# EasyEDA Pro project 四路舵机降压板.epro, board PCB1
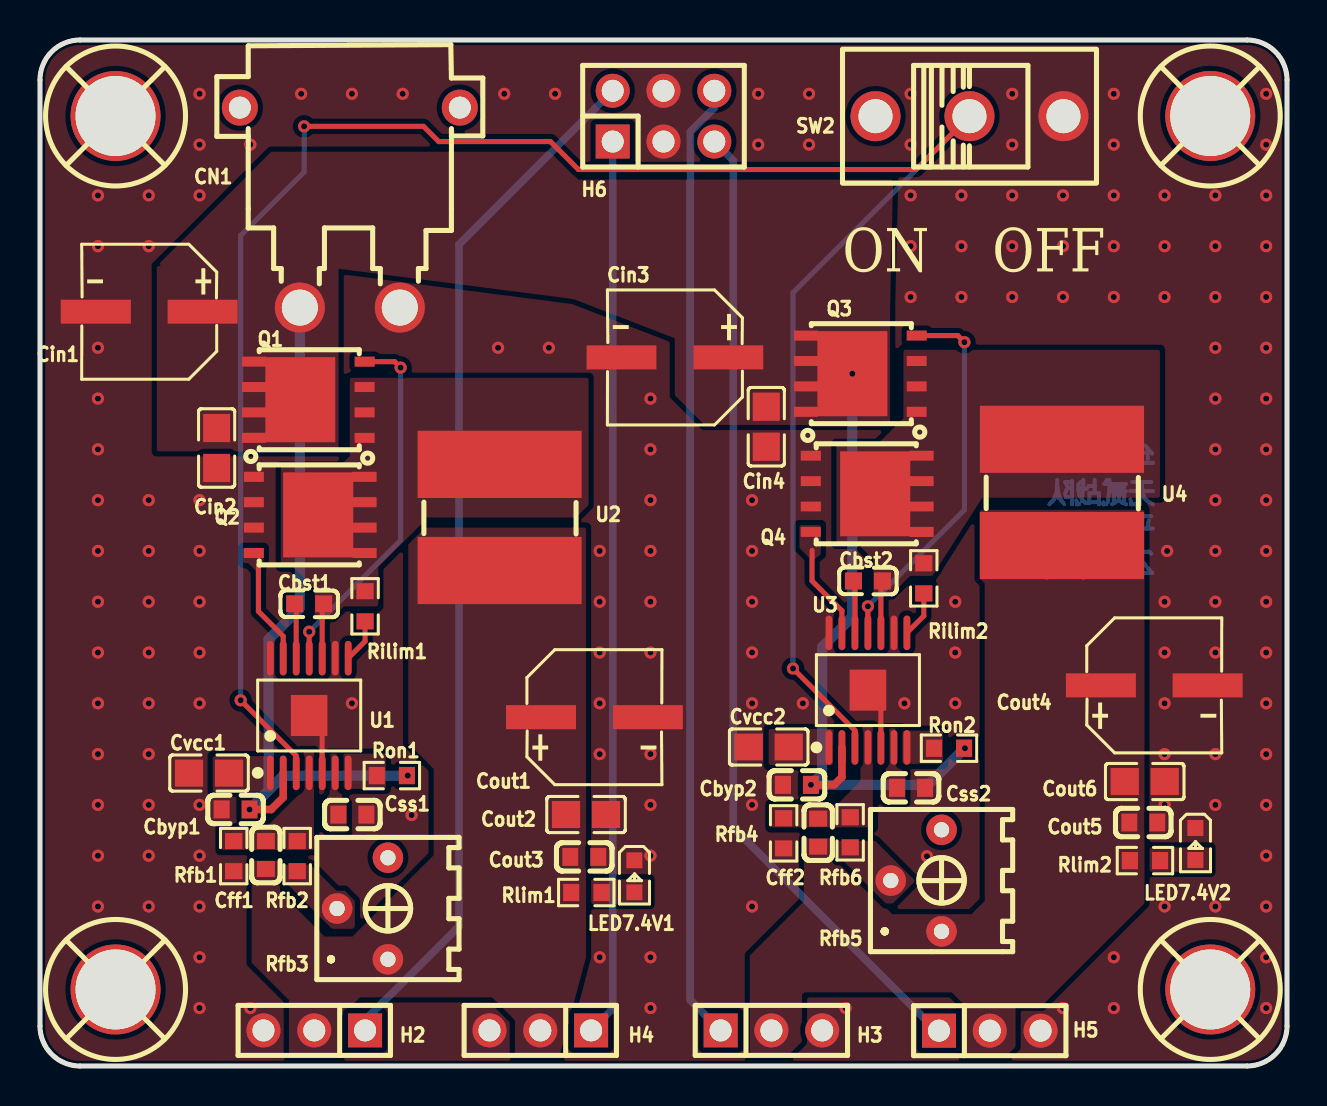
[diagram p3: board, top side]
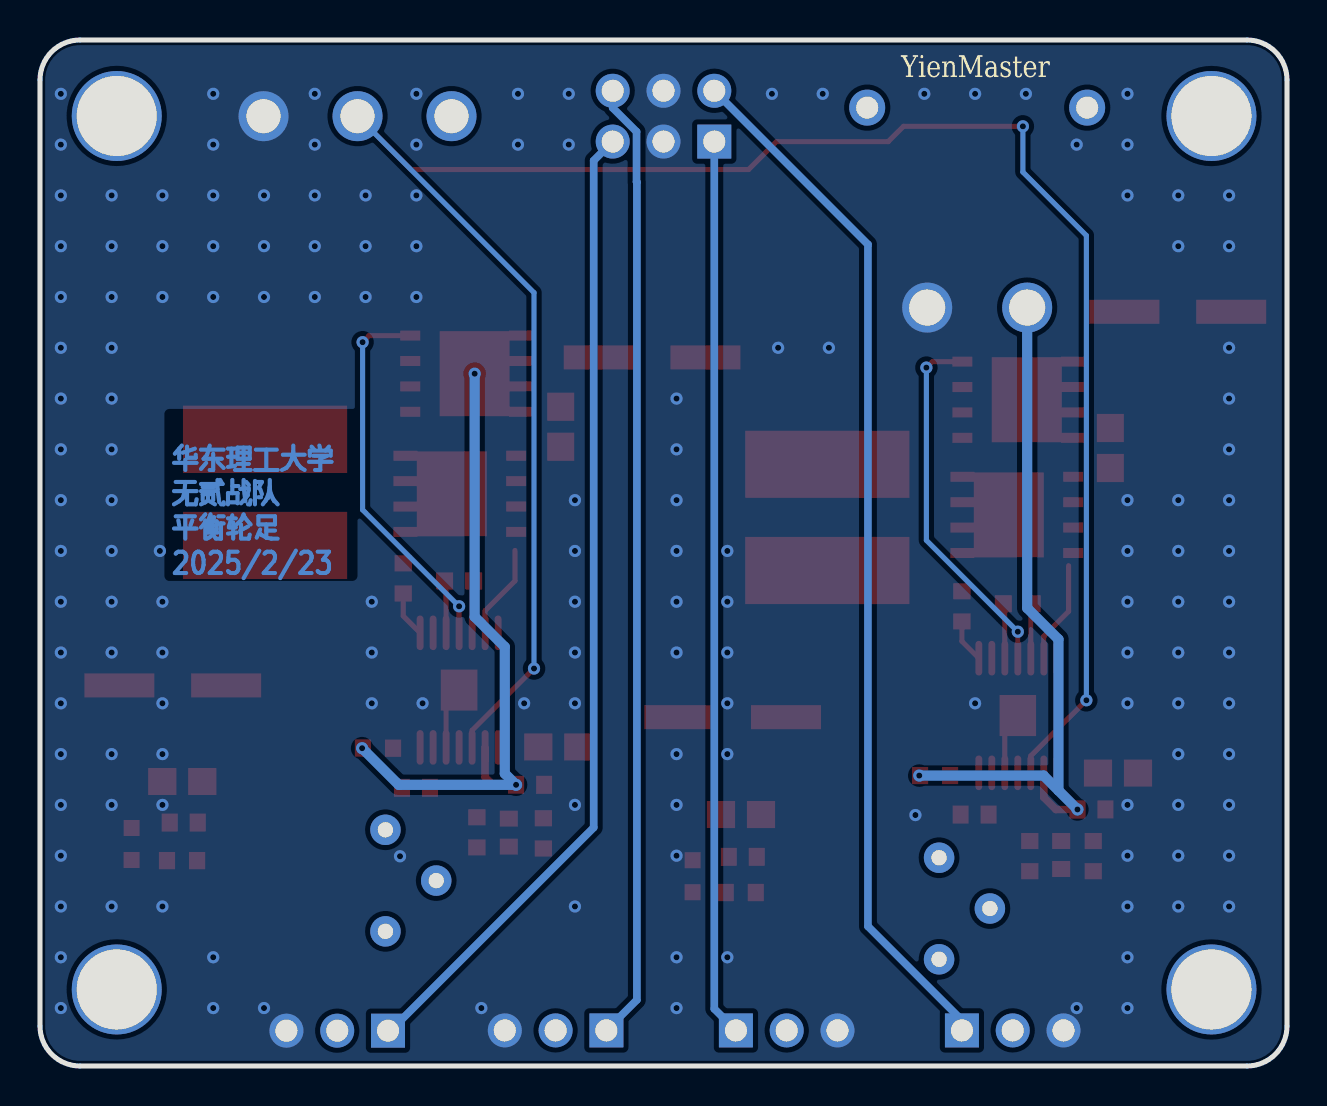
[diagram p4: board, bottom side, seen from below]

Outline 62.36 x 51.31 mm; copper layers: Top Layer, Bottom Layer. Coordinates in mm from the lower left corner of the outline.
Outline path: 0,49.31 0,2 arc(0.59,0.59) 2,0 60.36,0 arc(61.77,0.59) 62.36,2 62.36,49.31 arc(61.77,50.72) 60.36,51.31 2,51.31 arc(0.59,50.72) 0,49.31
Stack: Top Layer 0.035mm / Dielectric1 1.51mm FR4 er 4.5 / Bottom Layer 0.035mm

## Design rules (mm)
template: 自定义配置
spacing copperThickness1oz (default): track to track 0.102, other pairs 0.152 to 0.3
spacing copperThickness2oz: track to track 0.203, other pairs 0.152 to 0.3
track width copperThickness1oz (default): min 0.127, default 0.254, max 2.54
track width copperThickness2oz: min 0.203, default 0.254, max 2.54
differential pair differentialPair (default): width min 0.127, default 0.254, max 2.54; gap min 0.152, default 0.152
via viaSize (default): diameter min 0.5, default 0.61, max 10; hole min 0.3, default 0.305, max 6.3

## Placement (name value [footprint] x y rotation side)
Cbst1  470nF  [CAP-SMD_L1.6-W0.8-3]  13.46 23.12 180 top
Cbst2  470nF  [CAP-SMD_L1.6-W0.8-3]  41.4 24.26 180 top
Cbyp1  100nF  [C0603]  9.78 12.83 0 top
Cbyp2  100nF  [C0603]  37.85 14.06 0 top
Cff1  270pF  [C0603]  11.29 10.55 270 top
Cff2  270pF  [C0603]  38.92 11.67 270 top
Cin1  220uF  [CAP-SMD_BD6.3-L6.6-W6.6-LS7.4-FD]  5.46 37.72 180 top
Cin2  10uF  [C0805]  8.83 30.91 90 top
Cin3  220uF  [CAP-SMD_BD6.3-L6.6-W6.6-LS7.4-FD]  31.75 35.44 180 top
Cin4  10uF  [C0805]  36.32 31.97 90 top
CN1  XT30PW-M30.G.Y  [CONN-TH_XT30PW-M]  15.49 42.93 180 top
Cout1  220uF  [CAP-SMD_BD6.3-L6.6-W6.6-LS7.4-FD]  27.72 17.44 0 top
Cout2  10uF  [C0805]  27.31 12.58 180 top
Cout3  100nF  [C0603]  27.22 10.46 180 top
Cout4  220uF  [CAP-SMD_BD6.3-L6.6-W6.6-LS7.4-FD]  55.72 19.03 0 top
Cout5  100nF  [C0603]  55.17 12.18 180 top
Cout6  10uF  [C0805]  55.25 14.23 180 top
Css1  15nF  [C0603]  15.62 12.58 180 top
Css2  15nF  [C0603]  43.56 13.91 180 top
Cvcc1  2.2uF  [C0805]  8.45 14.65 0 top
Cvcc2  2.2uF  [C0805]  36.44 15.95 0 top
H2  PZ254V-11-03P  [HDR-TH_3P-P2.54-V-M]  13.72 1.78 180 top
H3  PZ254V-11-03P  [HDR-TH_3P-P2.54-V-M]  36.58 1.78 0 top
H4  PZ254V-11-03P  [HDR-TH_3P-P2.54-V-M]  25.02 1.78 180 top
H5  PZ254V-11-03P  [HDR-TH_3P-P2.54-V-M]  47.5 1.77 0 top
H6  PZ254V-12-6P  [HDR-TH_6P-P2.54-V-M-R2-C3-S2.54]  31.18 47.5 0 top
LED7.4V1  -  [LED_0603]  29.73 9.44 270 top
LED7.4V2  -  [LED_0603]  57.78 11.05 270 top
Q1  TPH1R403NL  [DSOP-8_L5.0-W5.0-P1.27-LS6.0-BL-EP]  13.47 33.32 90 top
Q2  TPH1R403NL  [DSOP-8_L5.0-W5.0-P1.27-LS6.0-BL-EP]  13.46 27.56 270 top
Q3  TPH1R403NL  [DSOP-8_L5.0-W5.0-P1.27-LS6.0-BL-EP]  41.07 34.62 90 top
Q4  TPH1R403NL  [DSOP-8_L5.0-W5.0-P1.27-LS6.0-BL-EP]  41.32 28.62 270 top
Rfb1  10kΩ  [R0603]  9.69 10.5 90 top
Rfb2  113kΩ  [R0603]  12.86 10.5 270 top
Rfb3  20kΩ  [RES-ADJ-TH_3362P]  16.13 7.88 90 top
Rfb4  10kΩ  [R0603]  37.19 11.63 90 top
Rfb5  20kΩ  [RES-ADJ-TH_3362P]  43.81 9.27 90 top
Rfb6  113kΩ  [R0603]  40.51 11.69 270 top
Rilim1  1.37kΩ  [R0603]  16.26 22.99 90 top
Rilim2  1.37kΩ  [R0603]  44.2 24.39 90 top
Rlim1  2.8kΩ  [R0603]  27.32 8.68 180 top
Rlim2  2.8kΩ  [R0603]  55.26 10.27 180 top
Ron1  267kΩ  [R0603]  17.6 14.52 180 top
Ron2  267kΩ  [R0603]  45.46 15.89 180 top
SCREW1  -  [M4螺丝]  3.78 3.83 0 top
SCREW2  -  [M4螺丝]  58.52 3.83 0 top
SCREW3  -  [M4螺丝]  3.78 47.51 0 top
SCREW4  -  [M4螺丝]  58.52 47.51 0 top
SW2  SS-12D10L3  [SW-TH_SS-12D10L3]  46.48 47.5 0 top
U1  LM3150MHX/NOPB  [HTSSOP-14_L5.0-W4.4-P0.65-LS6.4-BL-EP]  13.46 17.53 0 top
U2  3.3uH  [IND-SMD_L7.8-W7.6]  22.99 27.43 90 top
U3  LM3150MHX/NOPB  [HTSSOP-14_L5.0-W4.4-P0.65-LS6.4-BL-EP]  41.4 18.8 0 top
U4  3.3uH  [IND-SMD_L7.8-W7.6]  51.11 28.69 90 top

## Footprints (pads in the part's own frame, mm; a bottom-side part is the same pattern mirrored in y, then rotated)
C0603
  rect 0.8x0.9 smd: 1(-0.7,0) 2(0.7,0)
C0805
  rect 1.41x1.35 smd: 1(-1,0) 2(1,0)
CAP-SMD_BD6.3-L6.6-W6.6-LS7.4-FD
  rect 3.5x1.2 smd: 1(-2.67,0) 2(2.67,0)
CAP-SMD_L1.6-W0.8-3
  rect 0.85x0.85 smd: 1(-0.725,0) 2(0.725,0)
CONN-TH_XT30PW-M
  round 2.5 hole 1.8: 1(-2.5,5) 2(2.5,5)
  round 1.8 hole 1.1: 3(5.5,-5) 4(-5.5,-5)
DSOP-8_L5.0-W5.0-P1.27-LS6.0-BL-EP
  rect 0.5x1 smd: 1(-1.905,-2.77) 2(-0.635,-2.77) 3(0.634,-2.77) 4(1.905,-2.77)
  rect 0.5x1.2 smd: 5(1.905,2.77) 6(0.635,2.77) 7(-0.634,2.77) 8(-1.905,2.77)
  custom 4.25x3.5 smd: 9(0,0.45)
HDR-TH_3P-P2.54-V-M
  rect 1.7x1.7 hole 1.1: 1(-2.54,0)
  round 1.7 hole 1.1: 2(0,0) 3(2.54,0)
HDR-TH_6P-P2.54-V-M-R2-C3-S2.54
  rect 1.7x1.7 hole 1.1: 1(-2.54,-1.27)
  round 1.7 hole 1.1: 2(-2.54,1.27) 3(0,-1.27) 4(0,1.27) 5(2.54,-1.27) 6(2.54,1.27)
HTSSOP-14_L5.0-W4.4-P0.65-LS6.4-BL-EP
  oval 0.343x1.732 smd: 1(-1.95,-2.866) 2(-1.3,-2.866) 3(-0.65,-2.866) 4(0,-2.866) 5(0.65,-2.866) 6(1.3,-2.866) 7(1.95,-2.866) 8(1.95,2.866) 9(1.3,2.866) 10(0.65,2.866) 11(0,2.866) 12(-0.65,2.866) 13(-1.3,2.866) 14(-1.95,2.866)
  rect 1.83x2.055 smd: 15(0,0)
IND-SMD_L7.8-W7.6
  rect 3.36x8.208 smd: 1(2.655,0) 2(-2.655,0)
LED_0603
  rect 0.8x0.8 smd: 1(-0.851,-0.01) 2(0.75,-0.005)
M4螺丝
  round 4.5 hole 4: 1(0,0)
R0603
  rect 0.806x0.864 smd: 1(-0.753,0) 2(0.753,0)
RES-ADJ-TH_3362P
  round 1.524 hole 0.762: 1(-2.54,-1.27) 2(0,1.27) 3(2.54,-1.27)
SW-TH_SS-12D10L3
  round 2.5 hole 1.7: 1(-4.7,0) 2(0,0) 3(4.7,0)

## Nets
As in the schematic.

Pads without a net: CN1 3 4; Rfb3 3; Rfb5 3; SCREW1 1; SCREW2 1; SCREW3 1; SCREW4 1; SW2 1

## Via types
v1: diameter 0.61, hole 0.305, Top Layer to Bottom Layer, 162 vias

## Routing (per net, layer and track width the routed paths; a pad name or vN(x,y) marks a point on that pad's centre or on a via; arc(x,y) is an arc through that point)
GND: length 4.9
  Top Layer w0.254: U3.5 42.05,18.15 41.9,18.3 ; 13.96,17.03 14.11,16.88 U1.5
  vias: v1(2.9,43.54) v1(2.9,41) v1(2.9,35.92) v1(2.9,33.38) v1(2.9,30.84) v1(2.9,28.3) v1(2.9,25.76) v1(2.9,23.22) v1(2.9,20.68) v1(2.9,18.14) v1(2.9,15.6) v1(2.9,13.06) v1(2.9,10.52) v1(2.9,7.98) v1(5.44,43.54) v1(5.44,41) v1(5.44,28.3) v1(5.44,25.76) v1(5.44,23.22) v1(5.44,20.68) v1(5.44,18.14) v1(5.44,15.6) v1(5.44,13.06) v1(5.44,10.52) v1(5.44,7.98) v1(7.98,48.62) v1(7.98,46.08) v1(7.98,43.54) v1(7.98,28.3) v1(7.98,25.76) v1(7.98,23.22) v1(7.98,20.68) v1(7.98,18.14) v1(7.98,13.06) v1(7.98,10.52) v1(7.98,7.98) v1(7.98,5.44) v1(7.98,2.9) v1(10.52,46.08) v1(10.52,2.9) v1(13.06,48.62) v1(15.6,48.62) v1(15.6,18.14) v1(18.14,48.62) v1(18.58,12.55) v1(22.91,35.92) v1(23.22,48.62) v1(25.45,35.92) v1(25.76,48.62) v1(27.99,25.76) v1(27.99,23.22) v1(27.99,20.68) v1(27.99,18.14) v1(27.99,15.6) v1(27.99,5.44) v1(30.53,33.38) v1(30.53,30.84) v1(30.53,28.3) v1(30.53,25.76) v1(30.53,23.22) v1(30.53,20.68) v1(30.53,15.6) v1(30.53,13.06) v1(30.53,10.52) v1(30.53,5.44) v1(30.53,2.9) v1(35.61,28.3) v1(35.61,25.76) v1(35.61,23.22) v1(35.61,20.68) v1(35.61,18.14) v1(35.61,13.06) v1(35.61,7.98) v1(35.92,48.62) v1(35.92,46.08) v1(38.15,18.14) v1(38.46,48.62) v1(38.46,46.08) v1(40.29,2.9) v1(43.23,18.14) v1(43.54,48.62) v1(43.54,46.08) v1(43.54,43.54) v1(43.54,41) v1(43.54,38.46) v1(44.36,10.49) v1(45.77,23.22) v1(45.77,20.68) v1(45.77,18.14) v1(46.08,43.54) v1(46.08,41) v1(46.08,38.46) v1(48.62,48.62) v1(48.62,46.08) v1(48.62,43.54) v1(48.62,41) v1(48.62,38.46) v1(51.16,43.54) v1(51.16,41) v1(51.16,38.46) v1(51.16,2.9) v1(53.7,48.62) v1(53.7,46.08) v1(53.7,43.54) v1(53.7,41) v1(53.7,38.46) v1(53.7,5.44) v1(53.7,2.9) v1(56.24,43.54) v1(56.24,41) v1(56.24,38.46) v1(56.24,23.22) v1(56.24,20.68) v1(56.24,18.14) v1(56.24,15.6) v1(56.24,13.06) v1(56.24,7.98) v1(56.37,25.76) v1(58.78,43.54) v1(58.78,41) v1(58.78,38.46) v1(58.78,35.92) v1(58.78,33.38) v1(58.78,30.84) v1(58.78,28.3) v1(58.78,25.76) v1(58.78,23.22) v1(58.78,20.68) v1(58.78,15.6) v1(58.78,13.06) v1(58.78,7.98) v1(61.32,48.62) v1(61.32,46.08) v1(61.32,43.54) v1(61.32,41) v1(61.32,38.46) v1(61.32,35.92) v1(61.32,33.38) v1(61.32,30.84) v1(61.32,28.3) v1(61.32,25.76) v1(61.32,23.22) v1(61.32,20.68) v1(61.32,18.14) v1(61.32,15.6) v1(61.32,13.06) v1(61.32,10.52) v1(61.32,7.98) v1(61.32,5.44) v1(61.32,2.9)
VIN: length 69.6
  Top Layer w0.381: v1(38.55,14.06) 39.71,14.06 40.1,14.45 U3.2 ; v1(10.48,12.83) 11.56,12.83 12.16,13.43 U1.2
  Bottom Layer w0.508: CN1.2 12.99,22.9 11.43,21.34 11.43,13.78 ; 11.43,13.78 12.17,14.52 v1(18.39,14.52) ; 11.43,13.78 v1(10.48,12.83) ; v1(46.25,15.89) 44.42,14.06 v1(38.55,14.06) 39.12,14.63 39.12,20.96 40.62,22.46 v1(40.62,34.62)
EN: length 106.6
  Top Layer w0.254: U3.3 40.75,16.78 v1(37.66,19.88) ; SW2.2 43.81,44.83 26.92,44.83 25.53,46.23 19.94,46.23 19.18,46.99 v1(13.21,46.99) ; U1.3 12.81,15.51 v1(10.03,18.29)
  Bottom Layer w0.254: v1(13.21,46.99) 13.21,44.71 10.03,41.53 v1(10.03,18.29) ; v1(37.66,19.88) 37.66,38.67 SW2.2
LG_1: length 5.1
  Top Layer w0.254: U1.13 12.16,21.5 10.92,22.73 10.92,25.02
LG_2: length 4.7
  Top Layer w0.254: 38.61,25.78 38.61,24.26 40.1,22.77 U3.13
PWM1: length 52.1
  Bottom Layer w0.381: H2.1 16.26,2.29 20.96,6.99 20.96,41.09 H6.2
PWM2: length 44.9
  Bottom Layer w0.381: H6.1 28.64,2.86 H4.1
PWM3: length 48.3
  Bottom Layer w0.381: H6.6 33.72,47.92 32.53,46.72 32.53,44.21 32.51,44.2 32.51,3.3 34.16,1.65
PWM4: length 49.2
  Bottom Layer w0.381: H6.5 34.67,45.28 34.67,11.93 44.96,1.64
$1N1218: length 18.2
  Top Layer w0.254: v1(18.03,34.93) 17.74,35.22 Q1.4 ; U1.11 v1(13.46,21.72)
  Bottom Layer w0.254: v1(13.46,21.72) 18.03,26.29 18.03,34.8
$1N1219: length 2.8
  Top Layer w0.254: U1.12 12.81,23.04 Cbst1.2
$1N1220: length 2.2
  Top Layer w0.254: U1.8 16.26,21.24 Rilim1.1
$1N1233: length 2.8
  Top Layer w0.254: 14.19,23.12 14.11,23.04 U1.10
$1N2712: length 19.1
  Top Layer w0.254: U3.11 v1(41.4,22.99) ; v1(46.23,36.2) 45.9,36.53 Q3.4
  Bottom Layer w0.254: v1(41.4,22.99) 46.23,27.81 v1(46.23,36.2)
$1N2713: length 2.6
  Top Layer w0.254: U3.12 40.75,24.18 Cbst2.2
$1N2714: length 2.3
  Top Layer w0.254: Rilim2.1 44.2,22.51 U3.8
$1N2738: length 2.6
  Top Layer w0.254: 42.13,24.26 42.05,24.18 U3.10

## Copper pours and planes (outline as drawn; the poured copper is in the pictures)
7.4V_1 on Top Layer: 10.58,10.27 12,10.27 12,8.7 14.22,6.48 15.79,6.48 12.61,3.3 12.45,3.3 10.58,5.17
7.4V_1 on Top Layer: 27.31,26.93 19.18,26.93 18.41,26.16 18.41,16.13 19.69,14.86 19.69,10.54 12.45,3.3 12.45,0.53 14.97,0.53 14.99,0.51 14.99,2.41 16,3.43 22.61,3.43 23.75,2.29 23.75,0.51 25.99,0.51 27.31,5.45
7.4V_2 on Top Layer: 46.99,27.81 55.23,27.81 55.23,8.14 50.11,3.02 48.79,3.02 48.79,0.96 48.34,0.52 46.2,0.52 46.2,3.08 45.59,3.69 38.23,3.69 38.1,3.56 38.1,1.22 37.41,0.53 35.5,0.53 35.5,5.53 38.21,8.24 38.21,11.39 39.63,11.39 39.63,10.59 42.62,7.59 46.58,7.59 47.24,8.26 47.24,24.13 46.99,24.39
GND on Top Layer: -4.95,53.47 63.88,53.47 63.88,-4.44 -4.95,-4.44
GND on Bottom Layer: -6.48,56.39 67.69,56.39 67.69,-5.59 -6.48,-5.59
VIN on Top Layer: 33.15,38.74 42.51,38.74 42.51,32.12 33.15,32.12
VIN on Top Layer: 42.66,44.33 26.92,44.33 25.53,45.72 11.56,45.72 5.84,40.01 14.73,40.01 14.86,39.88 26.67,38.36 31.75,36.39 31.75,33.54 33.23,32.06 42.36,32.06
VIN on Top Layer: 14.93,30.82 14.93,40.01 5.83,40.01 5.84,40 5.84,30.74 14.85,30.74
FB_1 on Top Layer: 9.03,11.88 11.25,11.88 13.08,13.72 13.08,15.76 13.7,15.76 13.7,10.8 9.03,10.8
FB_2 on Top Layer: 36.53,11.93 41.65,11.93 41.65,17.03 41.29,17.03 41.28,17.02 41.02,17.02 41.02,14.24 39.85,13.07 36.53,13.07
LG_1 on Top Layer: 11.18,25.91 10.16,25.91 10.16,25.15 10.41,25.15 10.79,24.77 11.06,24.77 11.06,25.03 11.18,25.15
LG_2 on Top Layer: 37.97,27.05 39.05,27.05 39.05,25.58 38.61,25.28 37.97,25.91
$1N1213 on Top Layer: 14.48,15.62 15.11,15.62 15.11,13.39 15.34,13.16 15.34,11.71 15.37,11.69 14.48,11.69 14.35,11.81 14.35,13.46 14.48,13.59
$1N1215 on Top Layer: 8.64,15.5 11.68,15.5 11.68,13.72 8.64,13.72
$1N1216 on Top Layer: 15.11,15.62 17.3,15.62 17.3,13.86 15.11,13.86
$1N1232 on Top Layer: 27.53,9.34 30.48,9.34 30.48,8.1 27.53,8.1
$1N1233 on Top Layer: 17.03,25.28 16.92,25.17 16.92,22.99 15.19,22.99 14.65,22.45 13.74,22.45 13.74,23.85 12.19,25.4 16.91,25.4
$1N1233 on Top Layer: 15.49,34.42 15.49,30.5 14.97,29.98 12.04,29.98 12.04,24.98 16.95,24.98 19.18,27.21 19.18,27.43 26.81,27.43 27.43,28.06 27.43,34.42 15.5,34.42
$1N1489 on Top Layer: 12.2,10.07 13.52,10.07 14.83,8.77 15.24,8.77 15.75,8.26 15.75,6.86 14.6,6.86 12.32,9.15 12.19,9.15 12.19,10.06
$1N2707 on Top Layer: 42.29,16.89 43.05,16.89 43.05,14.85 43.28,14.62 43.28,13.2 42.3,13.2 42.29,13.21
$1N2709 on Top Layer: 36.44,16.86 39.75,16.86 39.75,15.05 36.44,15.05
$1N2710 on Top Layer: 43.05,16.77 45.16,16.77 45.16,15.11 43.05,15.11
$1N2737 on Top Layer: 55.47,10.93 58.53,10.93 58.53,9.71 55.47,9.71
$1N2738 on Top Layer: 43.18,35.82 56.01,35.82 56.01,28.43 47.12,28.43 44.63,24.51 43.52,24.51 41.92,26.12 39.83,26.12 39.83,31.12 41.9,31.12 43.18,32.4
$1N2738 on Top Layer: 44.86,24.81 44.56,24.51 43.52,24.51 42.6,23.59 41.68,23.59 41.68,25.32 40.89,26.12 43.55,26.12
$1N2751 on Top Layer: 39.85,11.26 41.77,11.26 43.77,9.25 42.65,8.13 42.29,8.13 40.13,10.29 39.88,10.29 39.85,10.31

## Text on the board
Bottom Layer: 华东理工大学 / 无贰战队 / 平衡轮足 / 2025/2/23
Bottom Silkscreen Layer: YienMaster
Top Silkscreen Layer: ON | OFF
